# EAGLE design DS2482 Breakout (EAGLE 7.3.0)
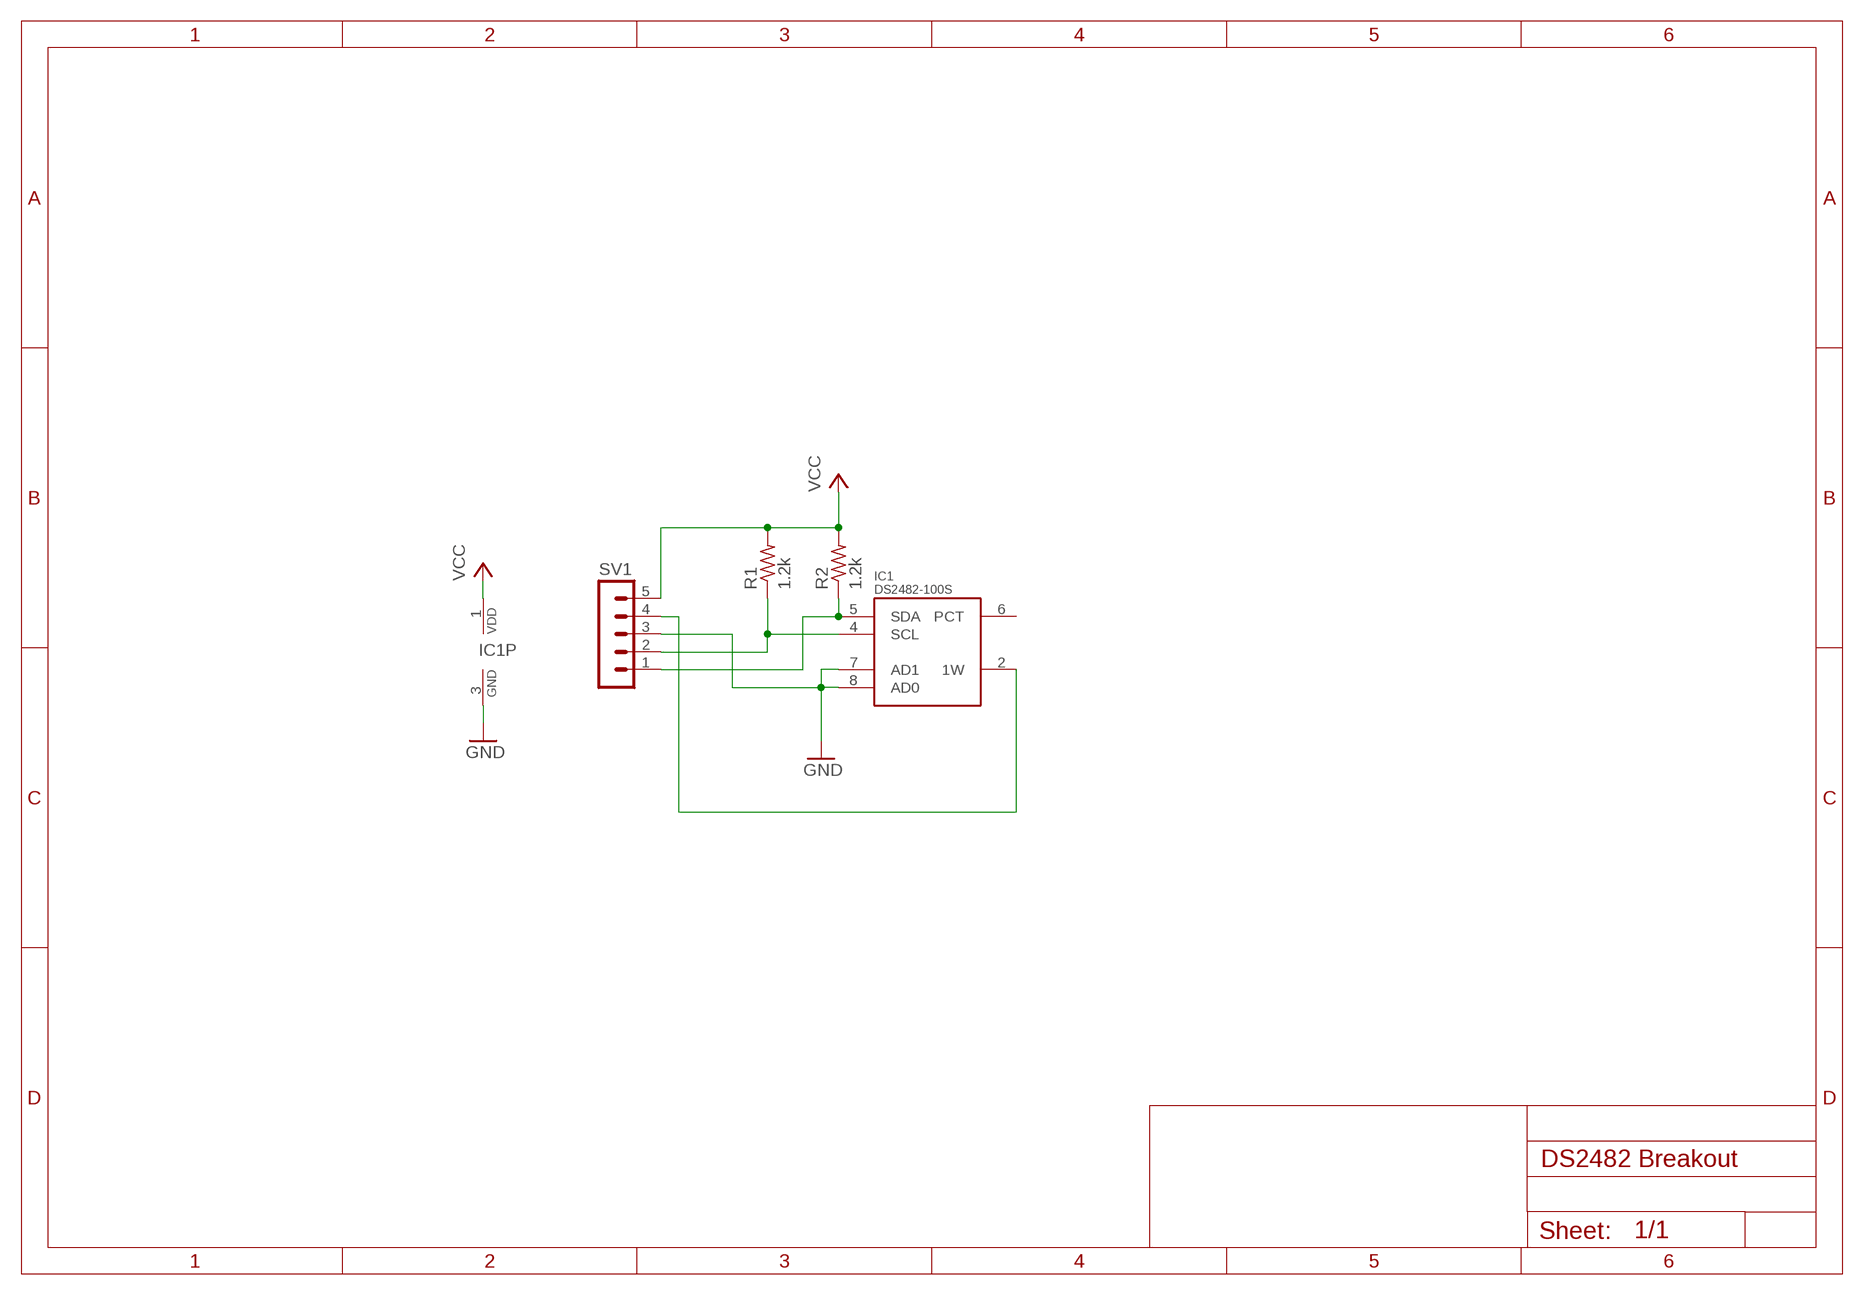
[diagram p0: schematic, sheet 1]

## Parts
IC1  DS2482-100S  [SO08]
R1  1.2k  R-US_M0805  [M0805]
R2  1.2k  R-US_M0805  [M0805]
SV1  MA05-1  [MA05-1]

## Nets
GND: IC1.3(GND) IC1.7(AD1) IC1.8(AD0) SV1.3
N$2: IC1.2(1W) SV1.4
SCL: IC1.4(SCL) R1.1 SV1.2
SDA: IC1.5(SDA) R2.1 SV1.1
VCC: IC1.1(VDD) R1.2 R2.2 SV1.5
Unconnected: IC1.6(PCT)

## Library data of the parts
IC1 = 1wire:DS2482-100: I2C to 1-Wire Host Adapter/Line Driver This device is a onewire host and I2C interface in one chip. It provides the complete DC/AC requirements for onewire communication, including overdrive speed mode, but, unlike the DS2480B chip, no 12V EPROM programming. Notes: For overdrive speed and 5V EEPROM programming, an external active pullup circuit must be connected to the 1W, VDD and PCT pin. See the datasheet for details. The lower two I2C adress bits of the chip can be selected by external pins, so up to 4 chips may be connected to the same I2C bus. Author: Orginal device and description from Giovanni Varasano <giovanni.varasano@fastwebnet.it> Improved by Jan Kandziora <jjj@gmx.de>
R1 R2 = rcl:R-US_: RESISTOR, American symbol
SV1 = con-lstb:MA05-1: PIN HEADER; OC_FARNELL: unknown; OC_NEWARK: unknown

## Board
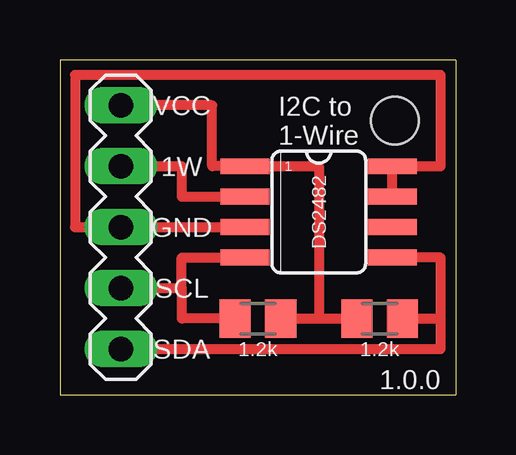
[diagram p1: board, top side]
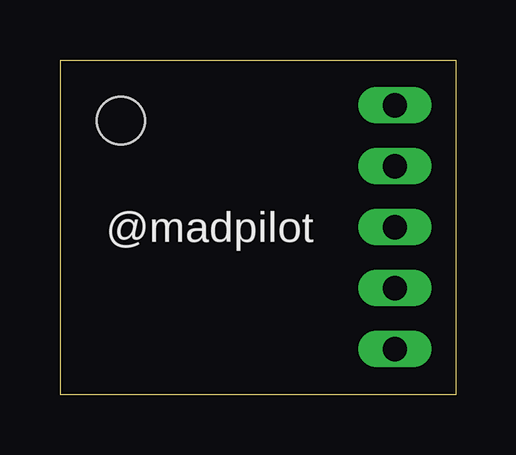
[diagram p2: board, bottom side, seen from below]

Size 16.51 x 13.96 mm. Coordinates in mm from the lower left corner, seen from the top.
Outline: 0,0 16.51,0 16.51,13.96 0,13.96 0,0
Copper layers (1*16): Top 0.0356mm / dielectric 1.5011mm / Bottom 0.0356mm
Design rules "LaenPCBOrder": minimum track width 6mil, minimum drill 13mil, track to track 6mil, track to pad 6mil, pad to pad 6mil, via to via 6mil, smd to smd 6mil, copper to edge 15mil, drill to drill 6mil, minimum pad ring 7mil, minimum via ring 7mil, stop-mask expansion 3mil, vias tented up to drill 0mil, thermal gap 10mil
Holes 2 mm at 13.97,11.43

### Footprints (pad centres in the part's own frame; a part is rotated, then mirrored left to right if it is on the bottom)
SO08 = smd 0.66 x 2.032: 1 -1.905,-3.073; 2 -0.635,-3.073; 3 0.635,-3.073; 4 1.905,-3.073; 5 1.905,3.073; 6 0.635,3.073; 7 -0.635,3.073; 8 -1.905,3.073
M0805 = smd 1.3 x 1.6: 1 -0.95,0; 2 0.95,0
MA05-1 = drill 1.016 long: 1 -5.08,0; 2 -2.54,0; 3 0,0; 4 2.54,0; 5 5.08,0

### Placement (x,y rotation side)
IC1  10.79,7.62 270 top
R1  8.26,3.17 0 top
R2  13.34,3.17 180 top
SV1  2.54,6.99 90 top

### Tracks (layer width: path | path; a pad name or v marks a point on that pad's centre or on a via)
GND
  Top 0.406: IC1.3 SV1.3 0.64,6.99 0.64,13.34 15.88,13.34 15.88,9.53 IC1.8 IC1.7
N$2
  Top 0.406: SV1.4 5.08,9.53 5.08,8.26 IC1.2
SCL
  Top 0.406: R1.1 5.08,3.17 5.08,4.45 | 5.08,4.45 5.08,5.71 IC1.4 | SV1.2 5.08,4.45
SDA
  Top 0.406: SV1.1 15.88,1.91 15.88,3.17 | 15.88,3.17 15.88,5.71 IC1.5 | R2.1 15.88,3.17
VCC
  Top 0.406: R1.2 10.79,3.17 | 10.79,3.17 R2.2 | SV1.5 6.35,12.06 6.35,9.53 IC1.1 10.79,9.53 10.79,3.17

### Text on the board
tPlace: VCC | I2C to / 1-Wire | 1W | 1 | DS2482 | GND | SCL | SDA | 1.2k | 1.2k | 1.0.0
bPlace: @madpilot